# Altium schematic sheet alimentation.SchDoc: Projet M1 2024
size A4; DrawnBy: J.CLEMENT & D.FOURNIER; Revision: V1.0 Rev A; SheetNumber: 2; SheetTotal: 7
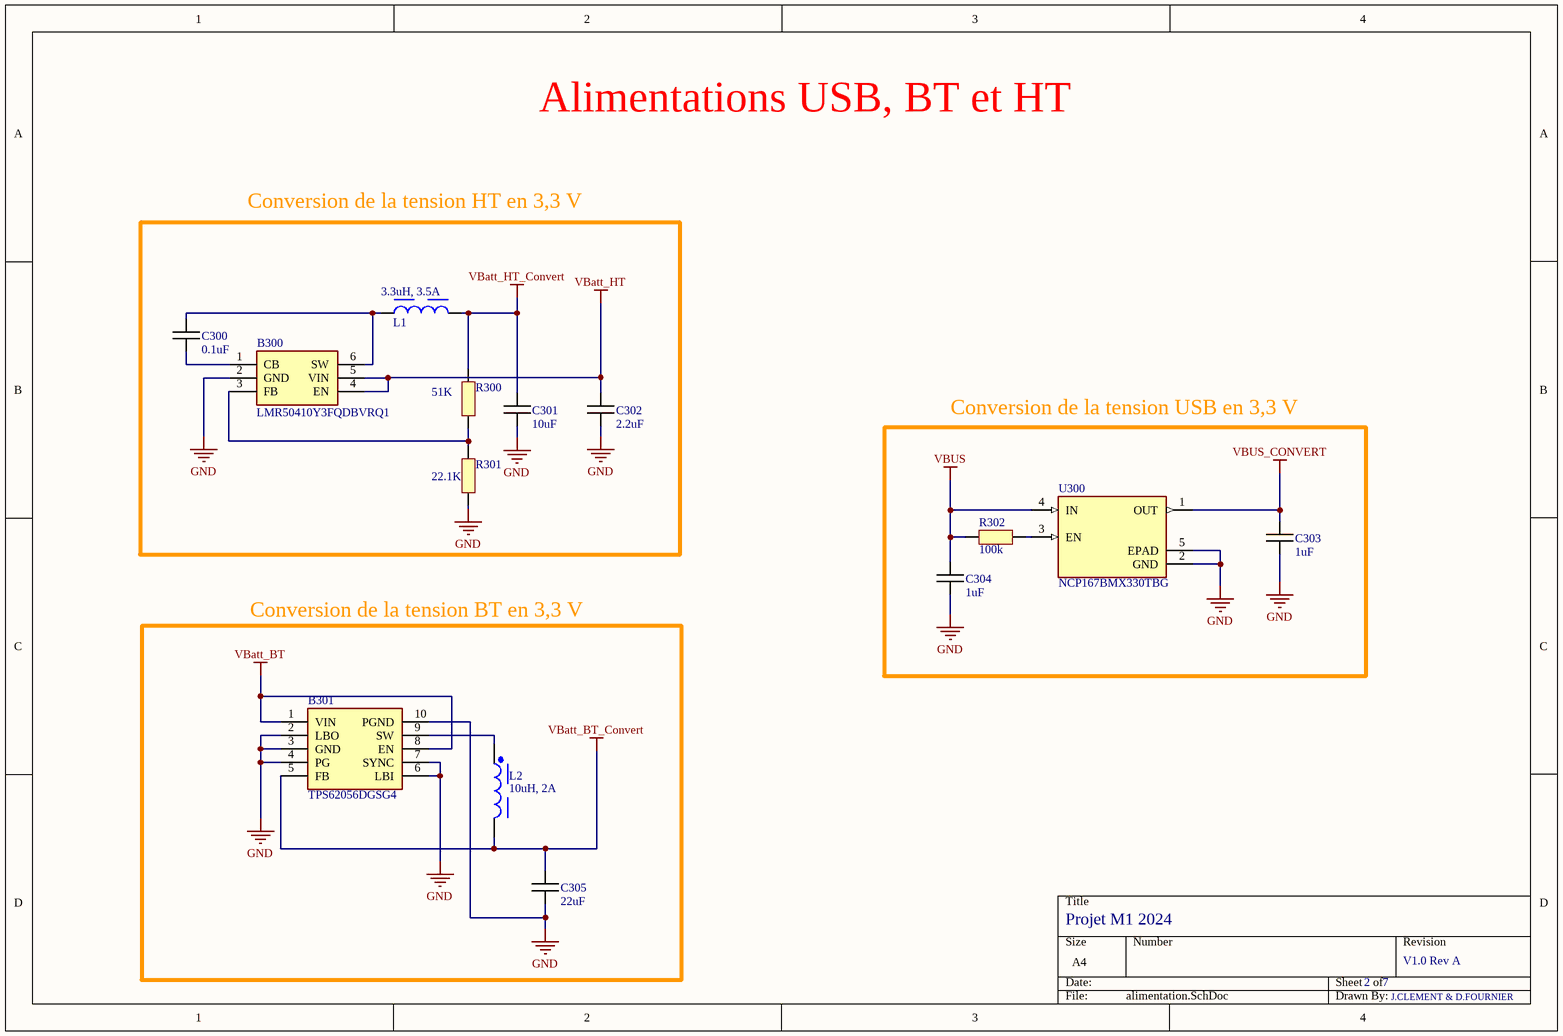
[diagram p0: alimentation.SchDoc]

## Parts
B300  LMR50410Y3FQDBVRQ1  [SOT95P280X145-6N]
B301  TPS62056DGSG4  [SOP50P490X110-10N]
C300  0.1uF  [CAPA_0603]
C301  10uF  [CAPA_0603]
C302  2.2uF  [CAPA_0603]
C303  1uF  [CAPA_0603]
C304  1uF  [CAPA_0603]
C305  22uF  [CAPA_0603]
L1  3.3uH, 3.5A  [WE-LHMI_4020]
L2  10uH, 2A  [WE-PD_7345]
R300  51K  [RES_0603]
R301  22.1K  [RES_0603]
R302  100k  [RES_0603]
U300  NCP167BMX330TBG  [NCP167BMX330TBG]

## Blocks framed on the sheet
Conversion de la tension HT en 3,3 V: B300 C300-C302 L1 R300 R301
Conversion de la tension USB en 3,3 V: C303 C304 R302 U300
Conversion de la tension BT en 3,3 V: B301 C305 L2

## Nets
GND: B300.2(GND) B301.2(LBO) B301.3(GND) B301.4(PG) B301.6(LBI) B301.7(SYNC) B301.10(PGND) C301.2 C302.2 C303.2 C304.2 C305.2 R301.1 U300.2(GND) U300.5(EPAD)
VBatt_BT: B301.1(VIN) B301.8(EN)
VBatt_BT_Convert: B301.5(FB) C305.1 L2.2
VBatt_HT: B300.4(EN) B300.5(VIN) C302.1
VBatt_HT_Convert: C301.1 L1.2 R300.2
VBUS: C304.1 R302.2 U300.4(IN)
VBUS_CONVERT: C303.1 U300.1(OUT)
NetB300_1: B300.1(CB) C300.2
NetB300_3: B300.3(FB) R300.1 R301.2
NetB300_6: B300.6(SW) C300.1 L1.1
NetB301_9: B301.9(SW) L2.1
NetR302_1: R302.1 U300.3(EN)

## Notes on the sheet
- Alimentations USB, BT et HT

## Library data of the parts
B300 = LMR50410Y3FQDBVRQ1: Régulateurs de tension de commutation Automotive qualified SIMPLE SWITCHER 4-V to 36-V, 1-A synchronous step-down converter 6-SOT-23 -40 to 150; Manufacturer_Name: Texas Instruments; Manufacturer_Part_Number: LMR50410Y3FQDBVRQ1; Mouser Part Number: 595-R50410Y3FQDBVRQ1
B301 = TPS62056DGSG4: TEXAS INSTRUMENTS - TPS62056DGSG4 - Synchronous Buck (Step Down) Switching Regulator, Fixed, 2.7V-10Vin, 3.3V/0.8A out, 850kHz, VSSOP-10; Manufacturer_Name: Texas Instruments; Manufacturer_Part_Number: TPS62056DGSG4; Mouser Part Number: 595-TPS62056DGSG4
C300-C305 = Capacitor
L1 = 74437324033: WE-LHMI SMT Power Inductor, size 4020, 3.3uH, 3.5A, 76mOhm; Manufacturer: Wurth Elektronik; Case/Size Code: 4020; DC Resistance: 69mOhm; Saturation Current @ 10%: 2.75A; Saturation Current @ 30%: 5.45A; Self Resonant Frequency: 40MHz; Manufacturer Part Number: 74437324033; Category: Power Inductors; Match Code: WE-LHMI; ComponentLink1Description: Website Link; ComponentLink1URL: https://www.we-online.com/redexpert/article/74437324033?ad; ComponentLink2Description: Datasheet Link; ComponentLink2URL: https://www.we-online.com/redexpert/spec/74437324033?ad; Mount: Surface Mount; Operating Temperature Max: 125°C; Operating Temperature Min: -40°C; Packaging: Tape and Reel; Length: 4.06mm; Width: 4.06mm; Height: 1.8mm; DC Resistance Max: 76mOhm; Inductance: 3.3uH; Performance Rated Current: 3.5A
L2 = 74477710: WE-PD SMT Power Inductor, size 7345, 10uH, 2A, 49mOhm; Manufacturer: Wurth Elektronik; Case/Size Code: 7345; DC Resistance: 45mOhm; Saturation Current: 2.6A; Self Resonant Frequency: 26MHz; Type: Standard; Manufacturer Part Number: 74477710; Category: Power Inductors; Match Code: WE-PD; ComponentLink1Description: Website Link; ComponentLink1URL: https://www.we-online.com/redexpert/article/74477710?ad; ComponentLink2Description: Datasheet Link; ComponentLink2URL: https://www.we-online.com/redexpert/spec/74477710?ad; Mount: Surface Mount; Operating Temperature Max: 125°C; Operating Temperature Min: -40°C; Packaging: Tape and Reel; Length: 7.3mm; Width: 7.3mm; Height: 4.5mm; DC Resistance Max: 49mOhm; Inductance: 10uH; Rated Current: 2A
R300-R302 = Resistor
U300 = NCP167BMX330TBG: Régulateurs de tension LDO LDO 700 MA ULTRA-LOW NOISE 3.3V